# EasyEDA Pro project speedPulserPro.epro

# Schematic brd_speedPulserPro
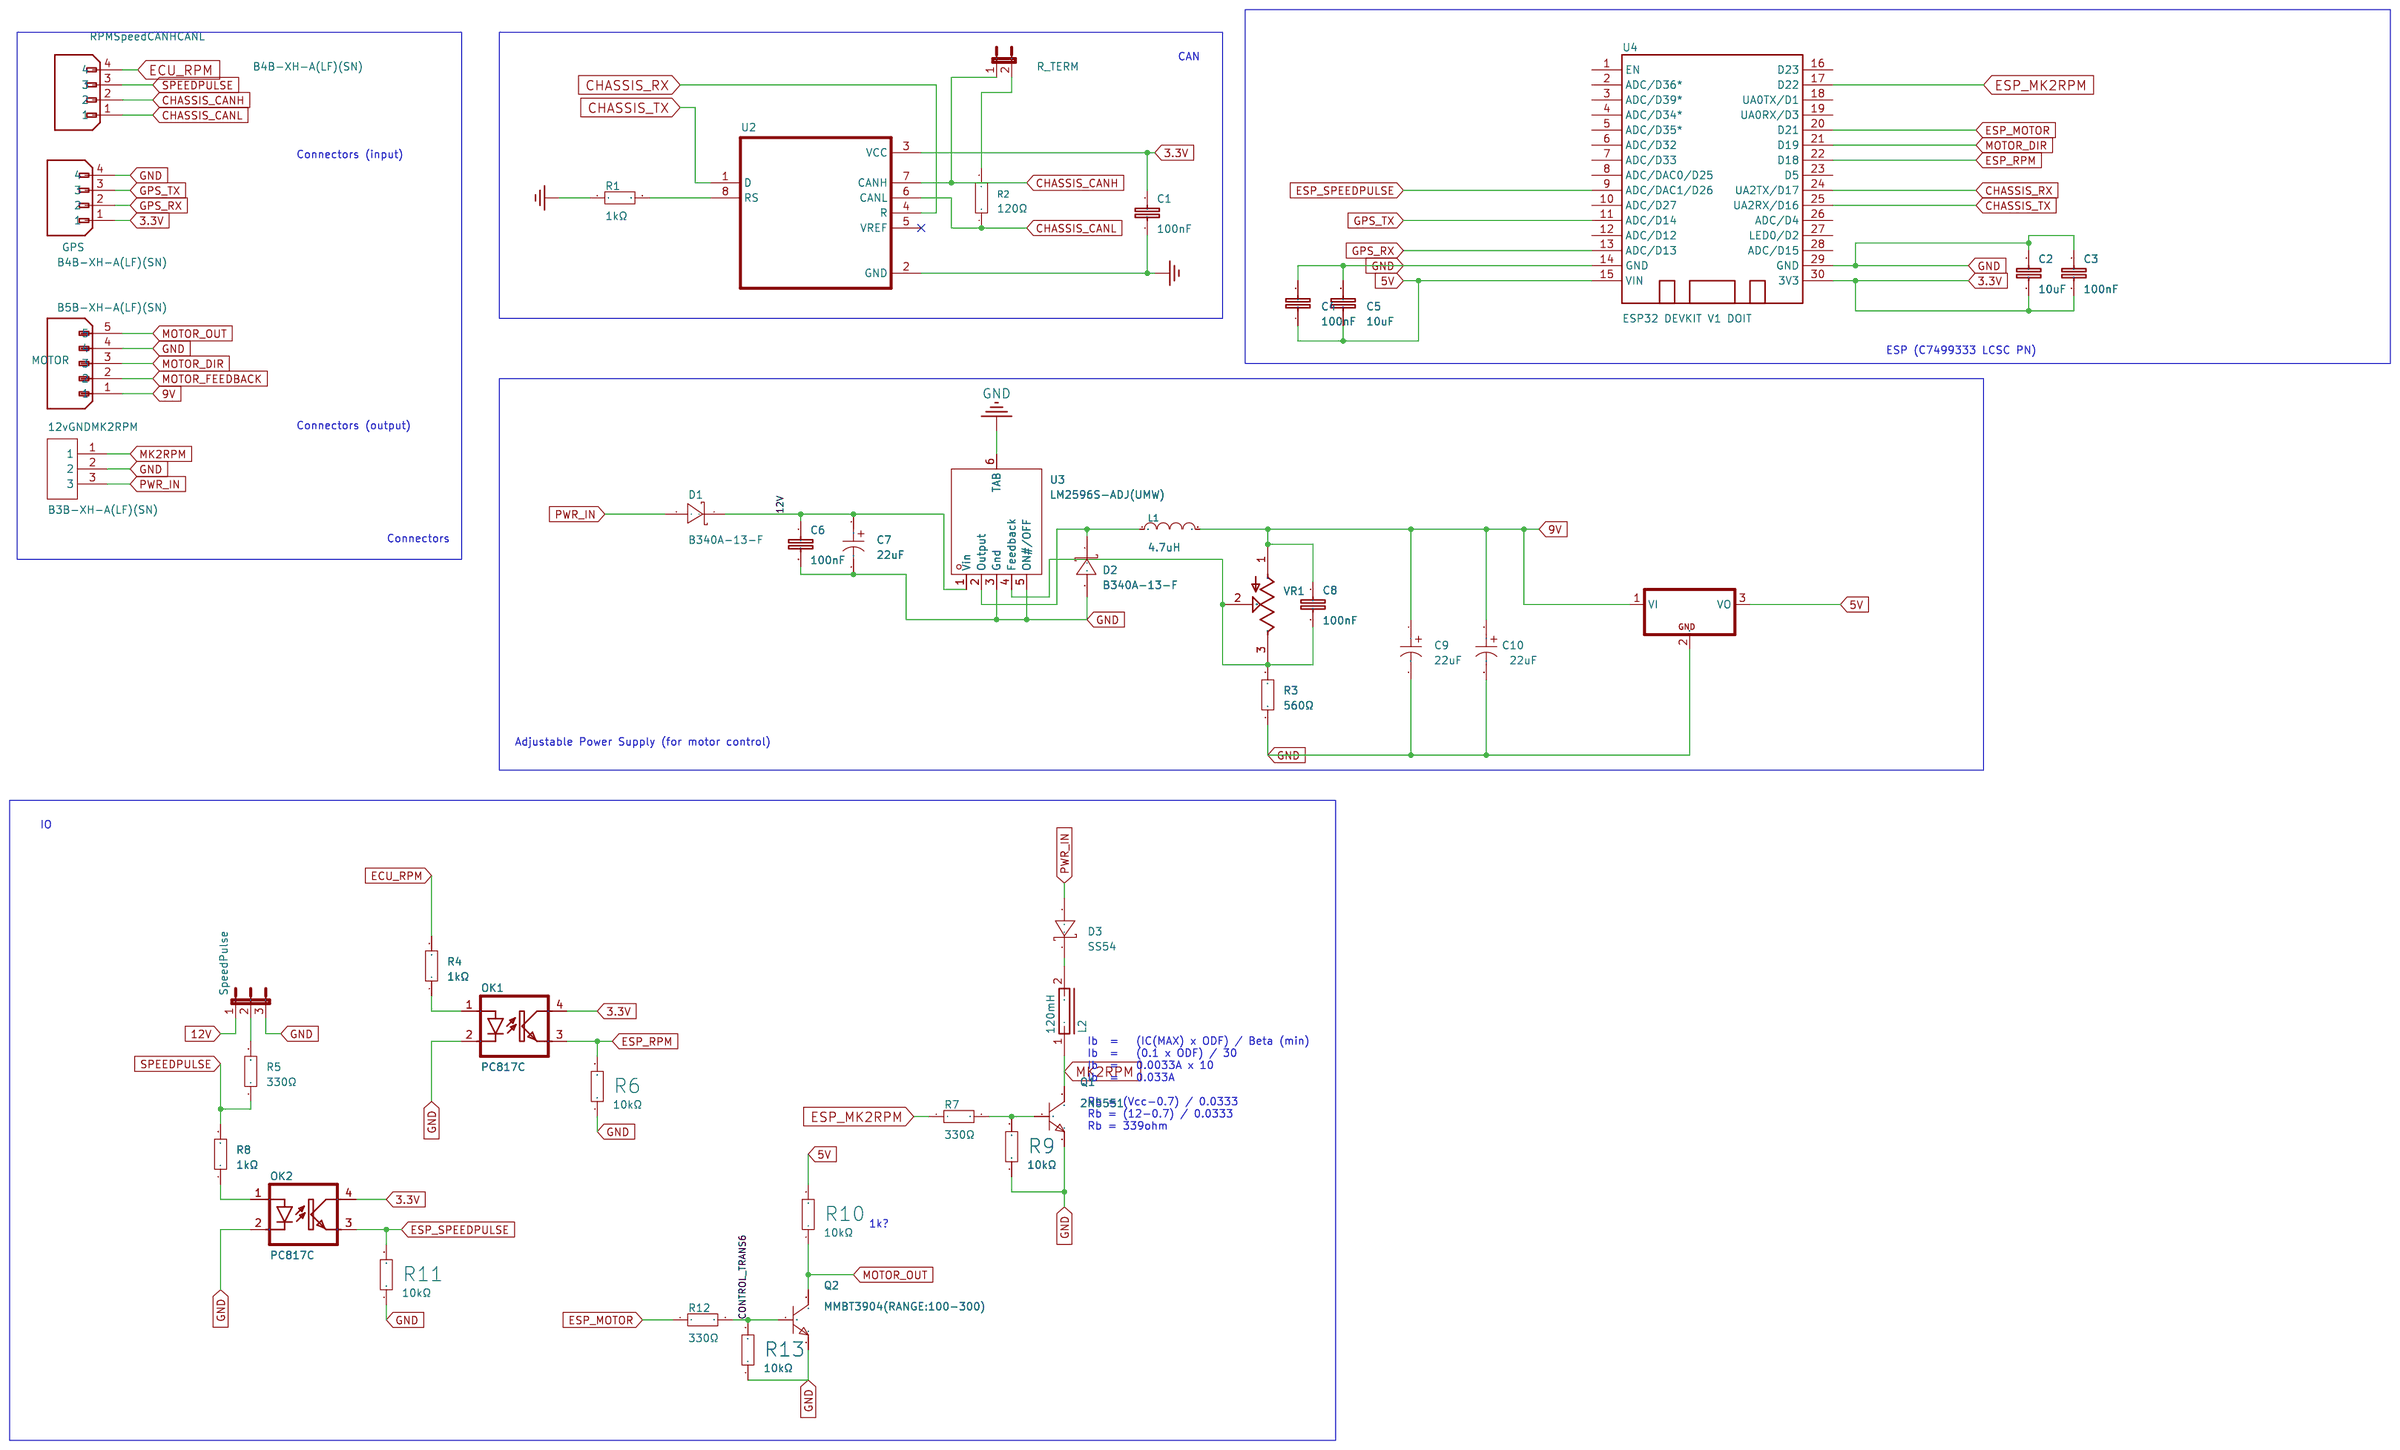
[diagram p0: schematic sheet]

## Parts
12vGNDMK2RPM  B3B-XH-A(LF)(SN)  [CONN-TH_3P-P2.50_A2501WV2-3P]
C1  100nF  [C0603]
C2  10uF  [C0805]
C3  100nF  [C0603]
C4  100nF  [C0603]
C5  10uF  [C0805]
C6  100nF  [C0805]
C7  22uF  [CAP-SMD_BD5.0-L5.3-W5.3-LS6.3-FD-1]
C8  100nF  [C0805]
C9  22uF  [CAP-SMD_BD5.0-L5.3-W5.3-LS6.3-FD-1]
C10  22uF  [CAP-SMD_BD5.0-L5.3-W5.3-LS6.3-FD-1]
D1  B340A-13-F  [SMA_L4.4-W2.6-LS5.0-RD]
D2  B340A-13-F  [SMA_L4.4-W2.6-LS5.0-RD]
D3  SS54  [SMA_L4.4-W2.8-LS5.4-R-RD]
GPS  B4B-XH-A(LF)(SN)  [CONN-TH_B4B-XH-A-LF-SN]
IC1  L7805ABD2T-TR  [TO-263-2_L10.0-W9.2-P5.08-LS15.3-TL-CW]
L1  4.7uH  [IND-SMD_L4.8-W4.5]
L2  120mH  [IND-SMD_L12.5-W12.5]
MOTOR  B5B-XH-A(LF)(SN)  [CONN-TH_B5B-XH-A-LF-SN]
OK1  PC817C  [OPTO-SMD-4_L4.6-W6.5-P2.54-LS10.3-TL]
OK2  PC817C  [OPTO-SMD-4_L4.6-W6.5-P2.54-LS10.3-TL]
Q1  2N5551  [SOT-23-3_L2.9-W1.4-P1.90-LS2.5-BR]
Q2  MMBT3904(RANGE:100-300)  [SOT-23-3_L2.9-W1.3-P1.90-LS2.4-BR]
R1  1kΩ  [R0603]
R2  120Ω  [R0603]
R3  560Ω  [R0603]
R4  1kΩ  [R0603]
R5  330Ω  [R0603]
R6  10kΩ  [R0603]
R7  330Ω  [R0603]
R8  1kΩ  [R0603]
R9  10kΩ  [R0603]
R10  10kΩ  [R0603]
R11  10kΩ  [R0603]
R12  330Ω  [R0603]
R13  10kΩ  [R0603]
R_TERM  PZ254V-11-02P  [HDR-TH_2P-P2.54-V-M]
RPMSpeedCANHCANL  B4B-XH-A(LF)(SN)  [CONN-TH_B4B-XH-A-LF-SN]
SpeedPulse  PZ254V-11-03P  [HDR-TH_3P-P2.54-V-M]
U2  SN65HVD230DR  [SOIC-8_L4.9-W3.9-P1.27-LS6.0-BL]
U3  LM2596S-ADJ(UMW)  [TO-263-5_L10.2-W8.9-P1.70-BR]
U4  ESP32 DEVKIT V1 DOIT  [DOIT-ESP32-DEVKIT-V1]
VR1  10kΩ  [RES-ADJ-TH_3362P]

## Library data of the parts
12vGNDMK2RPM = B3B-XH-A(LF)(SN): Pins Structure:1x3P Pitch:2.5mm Mounting Style:Direct Insert Reference Series:XH Number of Pins:3P Number of Rows:1 Number of PINs Per Row:3 Row Spacing:- Current Rating (Max):3A Contact Material:Brass Contact Plating:Tin Operating Temperature Range:-25℃~; LCSC Part Name: 1x3P 间距:2.5mm 直插 系列:XH; Supplier Part: C144394; Manufacturer: JST; Supplier Footprint: 插件,P=2.5mm; JLCPCB Part Class: Extended Part; Datasheet: https://atta.szlcsc.com/upload/public/pdf/source/20180928/C265283_F9DFEEBDB2CF642B6BDFAB4B77BD2680.pdf; Supplier: LCSC; Pins Structure: 1x3P; Pitch: 2.5mm; Mounting Style: Direct Insert; Reference Series: XH; Number of Pins: 3P; Number of Rows: 1; Number of PINs Per Row: 3; Current Rating (Max): 3A; Contact Material: Brass; Contact Plating: Tin; Operating Temperature Range: -25℃~+85℃; Rated Voltage (Max): 250V; Plastic Material: PA66; Flame Retardant Rating: UL94V-0; Supplementary Features: K-leg punch; Colour: White; Z-Height of the Board: 7mm; X-Length of Bottom Edge on Board (Spacing Line): 9.9mm; Y-Width of Bottom Edge on Board: 5.75mm
C1 C3 C4 = CC0603KRX7R9BB104: Capacitance:100nF Tolerance:±10% Tolerance:±10% Voltage Rating:50V Temperature Coefficient:X7R; LCSC Part Name: 100nF ±10% 50V; Supplier Part: C14663; Manufacturer: YAGEO(国巨); Supplier Footprint: 0603; JLCPCB Part Class: Basic Part; Datasheet: https://atta.szlcsc.com/upload/public/pdf/source/20250214/096C4C206003071F5D32E5F0D8E7F8DF.pdf; Supplier: LCSC; Tolerance: ±10%; Voltage Rating: 50V; Temperature Coefficient: X7R; Check: true
C2 C5 = CL21A106KAYNNNE_C15850: Capacitance: Tolerance:±10% Tolerance:±10% Voltage Rated: Temperature Coefficient:; LCSC Part Name: 10uF ±10% 25V; Supplier Part: C15850; Manufacturer: SAMSUNG(三星); Manufacturer Part: CL21A106KAYNNNE; Supplier Footprint: 0805; JLCPCB Part Class: Basic Part; Datasheet: https://atta.szlcsc.com/upload/public/pdf/source/20160218/1457707763339.pdf; Supplier: LCSC; Tolerance: ±10%; Check: true
C6 C8 = CT41G-0805-2X1-50V-0.1μF-K(N): Capacitance:100nF Tolerance:±10% Tolerance:±10% Voltage Rating:50V Temperature Coefficient:-; LCSC Part Name: 100nF ±10% 50V; Supplier Part: C126469; Manufacturer: TORCH(火炬); Supplier Footprint: 0805; JLCPCB Part Class: Extended Part; Datasheet: https://atta.szlcsc.com/upload/public/pdf/source/20171225/C150708_15141883600121203188.pdf; Supplier: LCSC; Tolerance: ±10%; Voltage Rating: 50V; Check: true
C7 C9 C10 = RST22UF35V025: Capacitance: Tolerance:±20% Tolerance:±20% Voltage Rated: Ripple Current:36mA@100kHz Equivalent Series Resistance(ESR):- Diameter: Height - Seated (Max): Lifetime @ Temp:2000hrs@105℃ Operating Temperature:-40℃~+105℃ Operating Temperature:-40℃~+105℃; LCSC Part Name: 22uF ±20% 35V; Supplier Part: C4747978; Manufacturer: KNSCHA(科尼盛); Supplier Footprint: SMD,D5xL5.4mm; JLCPCB Part Class: Extended Part; Datasheet: https://atta.szlcsc.com/upload/public/pdf/source/20220722/EA7DEE5E812CA06C1476767B895E1435.pdf; Supplier: LCSC; Tolerance: ±20%; Ripple Current: 36mA@100kHz; Lifetime @ Temp: 2000hrs@105℃; Operating Temperature: -40℃~+105℃; Check: true
D1 D2 = B340A-13-F: Forward Voltage (Vf@If):500mV@3A Reverse Voltage (Vr):40V Rectified Current:3A Reverse Leakage Current (Ir):500uA@40V; LCSC Part Name: 电压:40V 电流:3A; Supplier Part: C85098; Manufacturer: DIODES(美台); Supplier Footprint: SMA(DO-214AC); JLCPCB Part Class: Extended Part; Datasheet: https://atta.szlcsc.com/upload/public/pdf/source/20171023/C134454_15087453575121052549.pdf; Supplier: LCSC; Forward Voltage (Vf@If): 500mV@3A; Reverse Voltage (Vr): 40V; Rectified Current: 3A; Reverse Leakage Current (Ir): 500uA@40V; Check: true
D3 = SS54_C22452: Diode Configuration:Independent Type Forward Voltage (Vf@If):550mV@5A Reverse Voltage (Vr):40V Rectified Current:5A Reverse Leakage Current (Ir):1mA@40V; LCSC Part Name: 电压:40V 电流:5A; Supplier Part: C22452; Manufacturer: MDD(辰达半导体); Supplier Footprint: SMA(DO-214AC); JLCPCB Part Class: Basic Part; Datasheet: https://atta.szlcsc.com/upload/public/pdf/source/20240710/73DFBB65C1883B895E62D589679033DF.pdf; Supplier: LCSC; Diode Configuration: Independent Type; Forward Voltage (Vf@If): 550mV@5A; Reverse Voltage (Vr): 40V; Rectified Current: 5A; Reverse Leakage Current (Ir): 1mA@40V; Check: true
GPS RPMSpeedCANHCANL = B4B-XH-A(LF)(SN): Pins Structure:1x4P Pitch:2.5mm Mounting Style:Direct Insert Reference Series:XH Number of Pins:4P Number of Rows:1 Number of PINs Per Row:4 Row Spacing:- Current Rating (Max):3A Contact Material:Brass Contact Plating:Tin Operating Temperature Range:-25℃~; LCSC Part Name: 1x4P 间距:2.5mm 直插 系列:XH; Supplier Part: C144395; Manufacturer: JST; Supplier Footprint: 插件,P=2.5mm; JLCPCB Part Class: Extended Part; Datasheet: https://atta.szlcsc.com/upload/public/pdf/source/20180928/C265283_F9DFEEBDB2CF642B6BDFAB4B77BD2680.pdf; Supplier: LCSC; Pins Structure: 1x4P; Pitch: 2.5mm; Mounting Style: Direct Insert; Reference Series: XH; Number of Pins: 4P; Number of Rows: 1; Number of PINs Per Row: 4; Current Rating (Max): 3A; Contact Material: Brass; Contact Plating: Tin; Operating Temperature Range: -25℃~+85℃; Rated Voltage (Max): 250V; Plastic Material: PA66; Flame Retardant Rating: UL94V-0; Supplementary Features: K-leg punch; Colour: White; Z-Height of the Board: 7mm; X-Length of Bottom Edge on Board (Spacing Line): 12.4mm; Y-Width of Bottom Edge on Board: 5.75mm; Check: true
IC1 = L7805ABD2T-TR: Output Type:Fixed Maximum Input Voltage:35V Output Voltage:5V Output Voltage:5V Output Current:1.5A Power Supply Rejection Ratio (PSRR):68dB@(120Hz) Dropout Voltage:2V@(1A) standby current:6mA Feature:Short-Circuit  Protection；Thermal Protection(TSD) Oper; LCSC Part Name: 正稳压器IC; Supplier Part: C86206; Manufacturer: ST(意法半导体); Supplier Footprint: TO-263-2; JLCPCB Part Class: Extended Part; Datasheet: https://atta.szlcsc.com/upload/public/pdf/source/20191219/C472632_C0855675BBC73B8C8E44EE1325AAD56A.pdf; Supplier: LCSC; Output Type: Fixed; Maximum Input Voltage: 35V; Output Voltage: 5V; Output Current: 1.5A; Power Supply Rejection Ratio (PSRR): 68dB@(120Hz); Dropout Voltage: 2V@(1A); standby current: 6mA; Feature: Short-Circuit  Protection；Thermal Protection(TSD); Operating Temperature: -40℃~+125℃; Output Polarity: Positive electrode; Number of Outputs: 1; Check: true
L1 = SMMS0420-4R7M: Inductance: Tolerance:±20% Tolerance:±20% Rated Current: Saturation Current (Isat):3A DC Resistance (DCR): Type:一体成型电感; LCSC Part Name: 4.7uH ±20% 3A; Supplier Part: C133193; Manufacturer: SXN(顺翔诺); Supplier Footprint: SMD; JLCPCB Part Class: Extended Part; Datasheet: https://atta.szlcsc.com/upload/public/pdf/source/20210810/BBF24330FB2F5029F637830BA9C42C0D.pdf; Supplier: LCSC; Tolerance: ±20%; Saturation Current (Isat): 3A; Type: 一体成型电感; Check: true
L2 = DR125-124-R: Inductance:120mH Tolerance:±20% Tolerance:±20% Current Rating:60mA Current - Saturation(Isat):69mA DC Resistance(DCR):150Ω Type:- Ratings:-; LCSC Part Name: 120mH ±20% 69mA; Supplier Part: C2453120; Manufacturer: EATON(伊顿); Supplier Footprint: SMD,12.5x12.5mm; JLCPCB Part Class: Extended Part; Datasheet: https://atta.szlcsc.com/upload/public/pdf/source/20210417/1890D5F29C45E96B4D8E6D27BBAB5A55.pdf; Supplier: LCSC; Tolerance: ±20%; Current Rating: 60mA; Current - Saturation(Isat): 69mA; DC Resistance(DCR): 150Ω; Check: true
MOTOR = B5B-XH-A(LF)(SN): Pins Structure:1x5P Pitch:2.5mm Mounting Style:Direct Insert Reference Series:XH Number of Pins:5P Number of Rows:1 Number of PINs Per Row:5 Row Spacing:- Current Rating (Max):3A Contact Material:Brass Contact Plating:Tin Operating Temperature Range:-25℃~; LCSC Part Name: 1x5P 间距:2.5mm 直插 系列:XH; Supplier Part: C157991; Manufacturer: JST; Supplier Footprint: 插件,P=2.5mm; JLCPCB Part Class: Extended Part; Datasheet: https://atta.szlcsc.com/upload/public/pdf/source/20180928/C265283_F9DFEEBDB2CF642B6BDFAB4B77BD2680.pdf; Supplier: LCSC; Pins Structure: 1x5P; Pitch: 2.5mm; Mounting Style: Direct Insert; Reference Series: XH; Number of Pins: 5P; Number of Rows: 1; Number of PINs Per Row: 5; Current Rating (Max): 3A; Contact Material: Brass; Contact Plating: Tin; Operating Temperature Range: -25℃~+85℃; Rated Voltage (Max): 250V; Plastic Material: PA66; Flame Retardant Rating: UL94V-0; Supplementary Features: K-leg punch; Colour: White; Z-Height of the Board: 7mm; X-Length of Bottom Edge on Board (Spacing Line): 14.9mm; Y-Width of Bottom Edge on Board: 5.75mm; Check: true
OK1 OK2 = PC817C_C3025164: Input voltage type:DC Output Type:Phototransistor Voltage - Forward(Vf):1.2V Output Current:50mA Isolation Voltage(Vrms):5kV Reverse Voltage:6V Load Voltage:35V Number of Outputs:1 Vce Saturation(VCE(sat)):100mV@1mA,20mA Rise time:6us@2mA,100Ω Fall time:5; LCSC Part Name: C档 PC817C C档; Supplier Part: C3025164; Manufacturer: GOODWORK(固得沃克); Supplier Footprint: SMD-4P; JLCPCB Part Class: Extended Part; Datasheet: https://atta.szlcsc.com/upload/public/pdf/source/20240617/7F1B42AFA4D9649DF13B74B1E0B1F256.pdf; Supplier: LCSC; Input voltage type: DC; Output Type: Phototransistor; Voltage - Forward(Vf): 1.2V; Output Current: 50mA; Isolation Voltage(Vrms): 5kV; Reverse Voltage: 6V; Load Voltage: 35V; Number of Outputs: 1; Vce Saturation(VCE(sat)): 100mV@1mA,20mA; Rise time: 6us@2mA,100Ω; Fall time: 5us@2mA,100Ω; Operating Temperature: -55℃~+110℃; Current Transfer Ratio (CTR) Minimum: 200%; Current Transfer Ratio (CTR) Maximum/Saturation Value: 400%; Check: true
Q1 = 2N5551_C7529570: Transistor Type: Collector Current (Ic): Collector-Emitter Breakdown Voltage (Vceo): Power Dissipation (Pd):625mW DC Current Gain (hFE@Ic,Vce):80@10mA,5V DC Current Gain (hFE@Ic,Vce):80@10mA,5V Transition Frequency (fT):80MHz Collector Cut-Off Current (Ic; LCSC Part Name: NPN 电流:1A 耐压:160V; Supplier Part: C7529570; Manufacturer: RUILON(瑞隆源); Supplier Footprint: SOT-23; JLCPCB Part Class: Extended Part; Datasheet: https://atta.szlcsc.com/upload/public/pdf/source/20231206/D621ADD1802AEB70BE68282CC20D67DB.pdf; Supplier: LCSC; Power Dissipation (Pd): 625mW; DC Current Gain (hFE@Ic,Vce): 80@10mA,5V; Transition Frequency (fT): 80MHz; Collector Cut-Off Current (Icbo): 100nA; Collector-Emitter Saturation Voltage (VCE(sat)@Ic,Ib): 500mV@50mA,5mA; Operating Temperature: -55℃~+150℃; Check: true
Q2 = MMBT3904(RANGE:100-300): type:NPN Current - Collector(Ic): Collector - Emitter Voltage VCEO:40V Pd - Power Dissipation:200mW DC Current Gain:100@10mA,1V DC Current Gain:100@10mA,1V Transition frequency(fT):300MHz Current - Collector Cutoff:100nA Vce Saturation(VCE(sat)):300mV Ope; LCSC Part Name: hfe=100~300; Supplier Part: C20526; Manufacturer: CJ(江苏长电/长晶); Supplier Footprint: SOT-23; JLCPCB Part Class: Basic Part; Datasheet: https://atta.szlcsc.com/upload/public/pdf/source/20220704/70F575FB75061E03F919270A6BB8BA7F.pdf; Supplier: LCSC; type: NPN; Collector - Emitter Voltage VCEO: 40V; Pd - Power Dissipation: 200mW; DC Current Gain: 100@10mA,1V; Transition frequency(fT): 300MHz; Current - Collector Cutoff: 100nA; Vce Saturation(VCE(sat)): 300mV; Check: true
R1 R4 R8 = 0603WAF1001T5E: Type:Thick Film Resistors Resistance:1kΩ Tolerance:±1% Tolerance:±1% Power(Watts): Overload Voltage (Max): Temperature Coefficient:±100ppm/℃ Temperature Coefficient:±100ppm/℃ Operating Temperature Range:-55℃~+155℃ Operating Temperature Range:-55℃~+155℃; LCSC Part Name: 1kΩ ±1% 100mW 厚膜电阻; Supplier Part: C21190; Manufacturer: UNI-ROYAL(厚声); Supplier Footprint: 0603; JLCPCB Part Class: Basic Part; Datasheet: https://atta.szlcsc.com/upload/public/pdf/source/20200306/C422600_1E6D84923E4A46A82E41ADD87F860B5C.pdf; Supplier: LCSC; Type: Thick Film Resistors; Tolerance: ±1%; Temperature Coefficient: ±100ppm/℃; Operating Temperature Range: -55℃~+155℃; Check: true
R2 = 0603WAF1200T5E: Type:Thick Film Resistors Resistance: Tolerance:±1% Tolerance:±1% Power(Watts): Overload Voltage (Max): Temperature Coefficient:±100ppm/℃ Temperature Coefficient:±100ppm/℃ Operating Temperature Range:-55℃~+155℃ Operating Temperature Range:-55℃~+155℃; LCSC Part Name: 120Ω ±1% 100mW 厚膜电阻; Supplier Part: C22787; Manufacturer: UNI-ROYAL(厚声); Supplier Footprint: 0603; JLCPCB Part Class: Basic Part; Datasheet: https://atta.szlcsc.com/upload/public/pdf/source/20200306/C422600_1E6D84923E4A46A82E41ADD87F860B5C.pdf; Supplier: LCSC; Type: Thick Film Resistors; Tolerance: ±1%; Temperature Coefficient: ±100ppm/℃; Operating Temperature Range: -55℃~+155℃; Check: true
R3 = 0603WAF5600T5E: Type:Thick Film Resistors Resistance: Tolerance:±1% Tolerance:±1% Power(Watts): Overload Voltage (Max): Temperature Coefficient:±100ppm/℃ Temperature Coefficient:±100ppm/℃ Operating Temperature Range:-55℃~+155℃ Operating Temperature Range:-55℃~+155℃; LCSC Part Name: 560Ω ±1% 100mW 厚膜电阻; Supplier Part: C23204; Manufacturer: UNI-ROYAL(厚声); Supplier Footprint: 0603; JLCPCB Part Class: Basic Part; Datasheet: https://atta.szlcsc.com/upload/public/pdf/source/20200306/C422600_1E6D84923E4A46A82E41ADD87F860B5C.pdf; Supplier: LCSC; Type: Thick Film Resistors; Tolerance: ±1%; Temperature Coefficient: ±100ppm/℃; Operating Temperature Range: -55℃~+155℃; Check: true
R5 R7 R12 = 0603WAF3300T5E: Type:Thick Film Resistors Resistance: Tolerance:±1% Tolerance:±1% Power(Watts): Overload Voltage (Max): Temperature Coefficient:±100ppm/℃ Temperature Coefficient:±100ppm/℃ Operating Temperature Range:-55℃~+155℃ Operating Temperature Range:-55℃~+155℃; LCSC Part Name: 330Ω ±1% 100mW 厚膜电阻; Supplier Part: C23138; Manufacturer: UNI-ROYAL(厚声); Supplier Footprint: 0603; JLCPCB Part Class: Basic Part; Datasheet: https://atta.szlcsc.com/upload/public/pdf/source/20200306/C422600_1E6D84923E4A46A82E41ADD87F860B5C.pdf; Supplier: LCSC; Type: Thick Film Resistors; Tolerance: ±1%; Temperature Coefficient: ±100ppm/℃; Operating Temperature Range: -55℃~+155℃; Check: true
R6 R9-R11 R13 = 0603WAF1002T5E: Type:Thick Film Resistor Resistance:10kΩ Tolerance:±1% Tolerance:±1% Power(Watts):100mW Voltage-Supply(Max):75V Temperature Coefficient:±100ppm/℃ Temperature Coefficient:±100ppm/℃ Operating Temperature:-55℃~+155℃ Operating Temperature:-55℃~+155℃; LCSC Part Name: 厚膜电阻 10kΩ ±1% 100mW; Supplier Part: C25804; Manufacturer: UNI-ROYAL(厚声); Supplier Footprint: 0603; JLCPCB Part Class: Basic Part; Datasheet: https://atta.szlcsc.com/upload/public/pdf/source/20200306/C422600_1E6D84923E4A46A82E41ADD87F860B5C.pdf; Supplier: LCSC; Type: Thick Film Resistor; Tolerance: ±1%; Power(Watts): 100mW; Voltage-Supply(Max): 75V; Temperature Coefficient: ±100ppm/℃; Operating Temperature: -55℃~+155℃; Check: true
R_TERM = PZ254V-11-02P: Pin Structure:1x2P Pitch:2.54mm Row Spacing:- Circluar Pins/Square Pins:Policy Mounting Type:Straight Number of Rows:Single Row Number of Pins:2P Current Rating:- Voltage Rating (Max):- Length of Mating Pin:6mm Insulation Height:2.5mm Length of End Connec; LCSC Part Name: 1x2P 间距:2.54mm 方针 直插; Supplier Part: C492401; Manufacturer: XFCN(兴飞); Supplier Footprint: 插件,P=2.54mm; JLCPCB Part Class: Extended Part; Datasheet: https://atta.szlcsc.com/upload/public/pdf/source/20200309/C492401_A812433581A9B211A7FFA413ADDFF0E5.pdf; Supplier: LCSC; Pin Structure: 1x2P; Pitch: 2.54mm; Circluar Pins/Square Pins: Policy; Mounting Type: Straight; Number of Rows: Single Row; Number of Pins: 2P; Length of Mating Pin: 6mm; Insulation Height: 2.5mm; Length of End Connection Pin: 3mm; Contact Material: Brass; Operating Temperature: -40℃~+105℃; Color: Black; Check: true
SpeedPulse = PZ254V-11-03P: Pin Structure:1x3P Pitch:2.54mm Row Spacing:- Circluar Pins/Square Pins:Policy Mounting Type:Straight Number of Rows:Single Row Number of Pins:3P Current Rating:3A Voltage Rating (Max):250V Length of Mating Pin:6mm Insulation Height:2.5mm Length of End Co; LCSC Part Name: 1x3P 间距:2.54mm 方针 直插; Supplier Part: C2937625; Manufacturer: XFCN(兴飞); Supplier Footprint: 插件,P=2.54mm; JLCPCB Part Class: Extended Part; Datasheet: https://atta.szlcsc.com/upload/public/pdf/source/20200309/C492402_8335C3D49C4E4C618838D59BB1D024C1.pdf; Supplier: LCSC; Pin Structure: 1x3P; Pitch: 2.54mm; Circluar Pins/Square Pins: Policy; Mounting Type: Straight; Number of Rows: Single Row; Number of Pins: 3P; Current Rating: 3A; Voltage Rating (Max): 250V; Length of Mating Pin: 6mm; Insulation Height: 2.5mm; Length of End Connection Pin: 3mm; Operating Temperature: -40℃~+105℃; Color: Black; Check: true
U2 = SN65HVD230DR: Type:CANtransceiver Data Rate:1Mbps Voltage - Supply:- Voltage - Supply:- Current - Supply:- Operating Temperature:-40℃~+85℃ Operating Temperature:-40℃~+85℃; LCSC Part Name: 3.3-V CAN 收发器; Supplier Part: C12084; Manufacturer: TI(德州仪器); Supplier Footprint: SOIC-8; JLCPCB Part Class: Extended Part; Datasheet: https://www.ti.com/cn/lit/gpn/sn65hvd230; Supplier: LCSC; Type: CANtransceiver; Data Rate: 1Mbps; Operating Temperature: -40℃~+85℃; Check: true
U3 = LM2596S-ADJ(UMW): Function:Step-down type Output Type:Adjustable Input Voltage:40V Input Voltage:40V Output Voltage:1.2V~37V Output Voltage:1.2V~37V Output Current:3A Switching Frequency:150kHz Switching Frequency:150kHz Operating Temperature:-40℃~+125℃@(TA) Operating Temp; LCSC Part Name: 3A降压稳压器; Supplier Part: C347423; Manufacturer: UMW(友台半导体); Supplier Footprint: TO-263-5; JLCPCB Part Class: Extended Part; Datasheet: https://atta.szlcsc.com/upload/public/pdf/source/20241113/7515F50B4FEE0270D4DE7078364C87FA.pdf; Supplier: LCSC; Function: Step-down type; Output Type: Adjustable; Input Voltage: 40V; Output Voltage: 1.2V~37V; Output Current: 3A; Switching Frequency: 150kHz; Operating Temperature: -40℃~+125℃@(TA); Synchronous Rectification: No; Number of Outputs: 1; Topology: Step-down; Quiescent Current (Iq): 80uA; Switch tube (built-in/external): Built-in; Check: true
U4 = ESP32 DEVKIT V1 DOIT
VR1 = 3362P-1-103_C118956: Resistance: Tolerance:±10% Tolerance:±10%; LCSC Part Name: 10kΩ ±10%; Supplier Part: C118956; Manufacturer: BOCHEN(博晨); Manufacturer Part: 3362P-1-103; Supplier Footprint: 插件; JLCPCB Part Class: Extended Part; Datasheet: https://atta.szlcsc.com/upload/public/pdf/source/20171114/C118956_15106326650691117445.pdf; Supplier: LCSC; Tolerance: ±10%; Check: true

## Nets
3.3V: C1.1 C2.2 C3.2 GPS.1 OK1.4(COL) OK2.4(COL) U2.3(VCC) U4.30(3V3)
5V: C4.1 C5.1 IC1.3(VO) R10.2 U4.15(VIN)
9V: C8.1 C9.1 C10.1 IC1.1(VI) L1.2 MOTOR.1 VR1.1(CCW)
12V: C6.1 C7.1 D1.1(K) SpeedPulse.1 U3.1(Vin)
GND: 12vGNDMK2RPM.2 C1.2 C2.1 C3.1 C4.2 C5.2 C6.2 C7.2 C9.2 C10.2 D2.2(A) GPS.4 IC1.2(GND) MOTOR.4 OK1.2(C) OK2.2(C) Q1.2(E) Q2.2(E) R1.1 R3.1 R6.1 R9.1 R11.1 R13.1 SpeedPulse.3 U2.2(GND) U3.3(Gnd) U3.5(ON#/OFF) U3.6(TAB) U4.14(GND) U4.29(GND)
CHASSIS_CANH: R_TERM.1 RPMSpeedCANHCANL.2 U2.7(CANH)
CHASSIS_CANL: R2.1 RPMSpeedCANHCANL.1 U2.6(CANL)
CHASSIS_RX: U2.4(R) U4.24(UA2TX/D17)
CHASSIS_TX: U2.1(D) U4.25(UA2RX/D16)
CONTROL_TRANS6: Q2.1(B) R12.2 R13.2
ECU_RPM: R4.2 RPMSpeedCANHCANL.4
ESP_MK2RPM: R7.1 U4.17(D22)
ESP_MOTOR: R12.1 U4.20(D21)
ESP_RPM: OK1.3(EMIT) R6.2 U4.22(D18)
ESP_SPEEDPULSE: OK2.3(EMIT) R11.2 U4.9(ADC/DAC1/D26)
GPS_RX: GPS.2 U4.13(ADC/D13)
GPS_TX: GPS.3 U4.11(ADC/D14)
MK2RPM: 12vGNDMK2RPM.1 L2.1 Q1.3(C)
MOTOR_DIR: MOTOR.3 U4.21(D19)
MOTOR_FEEDBACK: MOTOR.2
MOTOR_OUT: MOTOR.5 Q2.3(C) R10.1
N$6: D2.1(K) L1.1 U3.2(Output)
N$7: C8.2 R3.2 U3.4(Feedback) VR1.2(WIPER) VR1.3(CW)
PWR_IN: 12vGNDMK2RPM.3 D1.2(A) D3.1(A)
SPEEDPULSE: R5.1 R8.2 RPMSpeedCANHCANL.3
$1N14244: R1.2 U2.8(RS)
$1N14293: R2.2 R_TERM.2
$1N14383: OK2.1(A) R8.1
$1N14386: R5.2 SpeedPulse.2
$1N14388: D3.2(K) L2.2
$1N14393: Q1.1(B) R7.2 R9.2
$1N14714: OK1.1(A) R4.1

Not connected (* = marked no-connect by the designer): U2 5(VREF)*; U4 1(EN) 2(ADC/D36*) 3(ADC/D39*) 4(ADC/D34*) 5(ADC/D35*) 6(ADC/D32) 7(ADC/D33) 8(ADC/DAC0/D25) 10(ADC/D27) 12(ADC/D12) 16(D23) 18(UA0TX/D1) 19(UA0RX/D3) 23(D5) 26(ADC/D4) 27(LED0/D2) 28(ADC/D15)

## Notes on the sheet
- CAN
- Connectors (input)
- ESP (C7499333 LCSC PN)
- Connectors (output)
- Connectors
- Adjustable Power Supply (for motor control)
- IO
- Ib  =   (IC(MAX) x ODF) / Beta (min)
  Ib  =   (0.1 x ODF) / 30
  Ib  =   0.0033A x 10
  Ib  =   0.033A
  Rb = (Vcc-0.7) / 0.0333
  Rb = (12-0.7) / 0.0333
  Rb = 339ohm
- 1k?

# Board brd_speedPulserPro
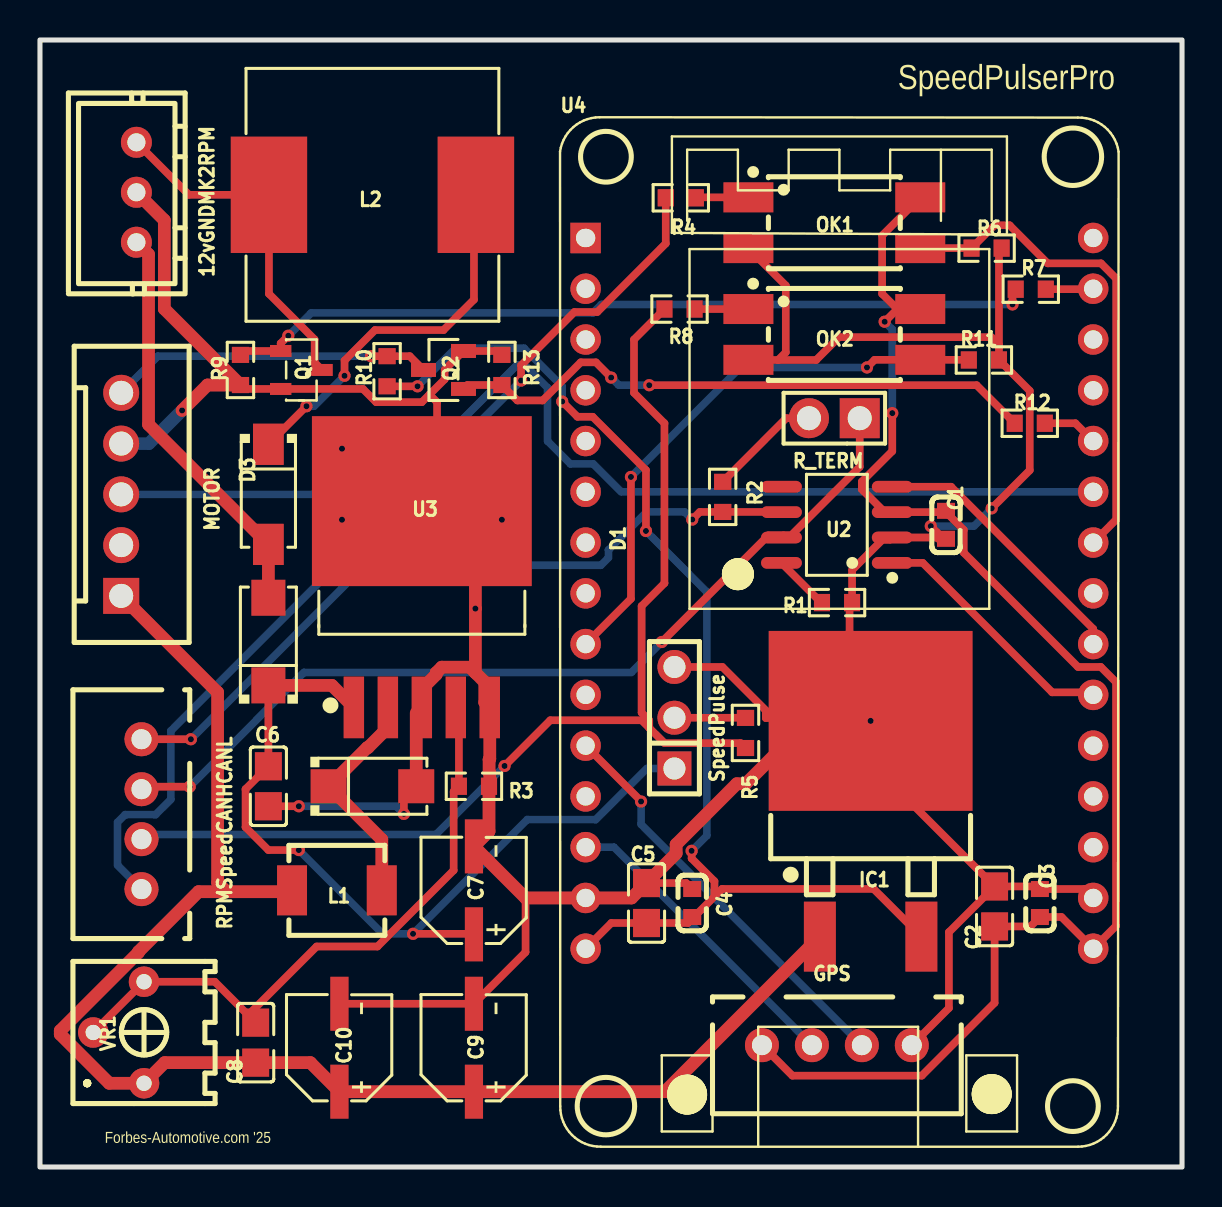
[diagram p1: board, top side]
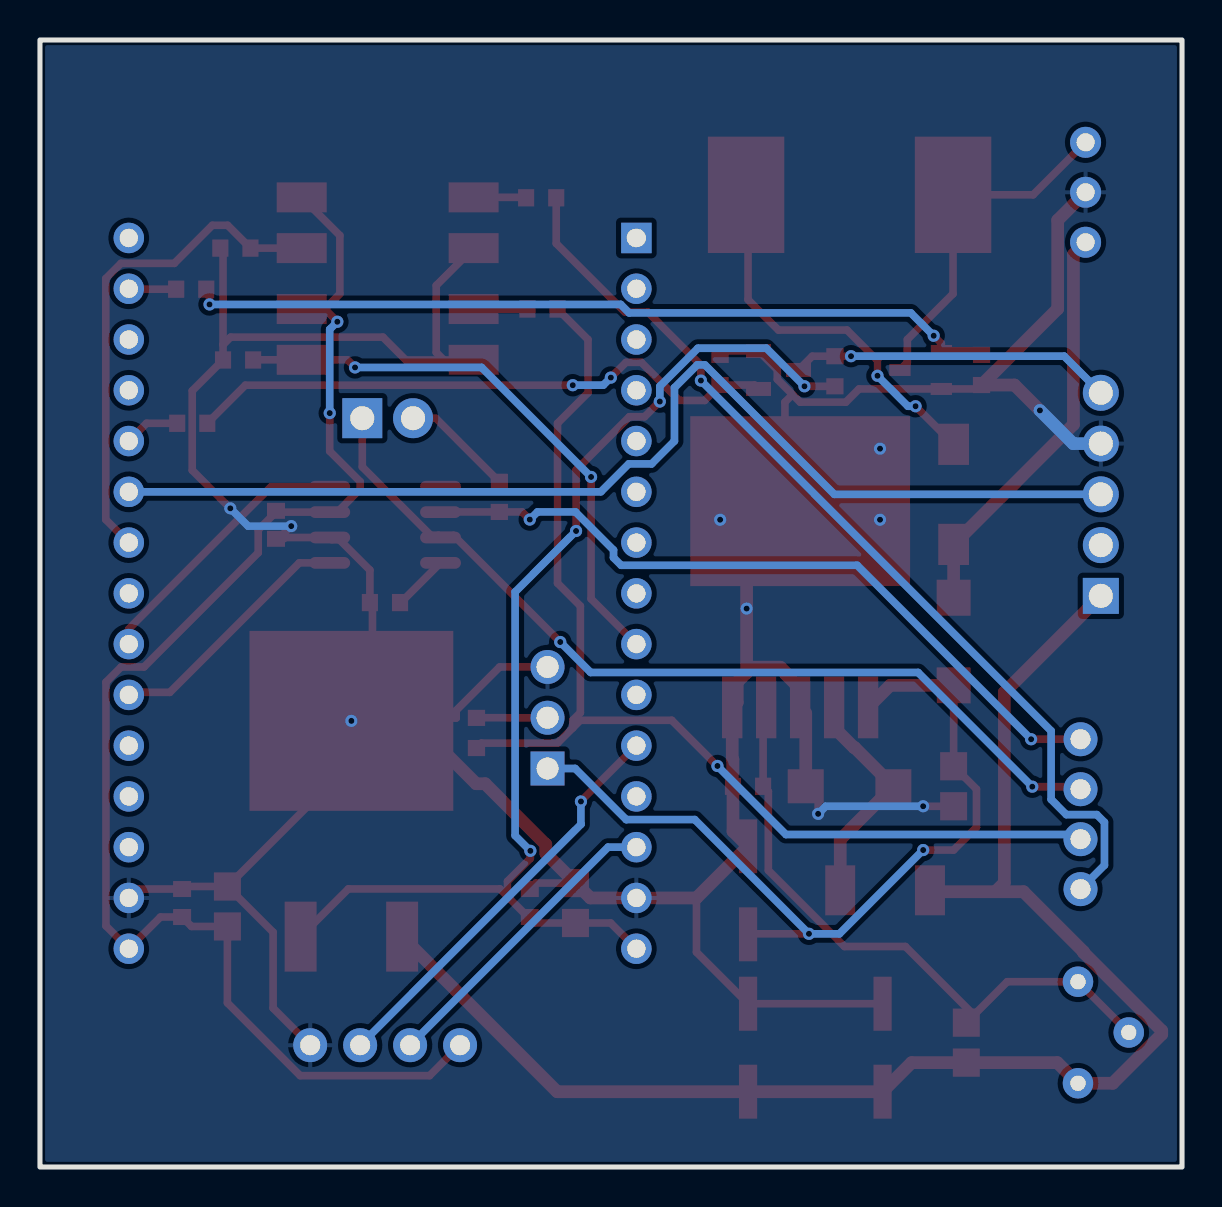
[diagram p2: board, bottom side, seen from below]

Outline 57.15 x 56.39 mm; copper layers: Top Layer, Bottom Layer. Coordinates in mm from the lower left corner of the outline.
Outline path: rectangle 0,56.39 57.15,0
Stack: Top Layer 0.035mm / Dielectric1 1.51mm FR4 er 4.5 / Bottom Layer 0.035mm

## Design rules (mm)
net CHASSIS_CANH: DP1
net CHASSIS_TX: DP2
net GPS_RX: DP3
net GPS_TX: DP3
net CHASSIS_CANL: DP1
net CHASSIS_RX: DP2
template: Custom Config
spacing copperThickness1oz (default): track to track 0.102, other pairs 0.152 to 0.3
spacing copperThickness2oz: track to track 0.203, other pairs 0.152 to 0.3
track width copperThickness1oz (default): min 0.305, default 0.381, max 2.54
track width copperThickness2oz: min 0.508, default 0.635, max 2.54
differential pair differentialPair (default): width min 0.127, default 0.254, max 2.54; gap min 0.152, default 0.152
via viaSize (default): diameter min 0.5, default 0.61, max 10; hole min 0.3, default 0.305, max 6.3
net 12V uses copperThickness2oz
net 9V uses copperThickness2oz

## Placement (name value [footprint] x y rotation side)
12vGNDMK2RPM  B3B-XH-A(LF)(SN)  [CONN-TH_3P-P2.50_A2501WV2-3P]  4.83 48.77 270 top
C1  100nF  [C0603]  45.34 32.13 270 top
C2  10uF  [C0805]  47.77 13.04 270 top
C3  100nF  [C0603]  50.04 13.21 270 top
C4  100nF  [C0603]  32.64 13.21 90 top
C5  10uF  [C0805]  30.35 13.21 90 top
C6  100nF  [C0805]  11.43 19.05 270 top
C7  22uF  [CAP-SMD_BD5.0-L5.3-W5.3-LS6.3-FD-1]  21.72 13.84 90 top
C8  100nF  [C0805]  10.8 6.22 90 top
C9  22uF  [CAP-SMD_BD5.0-L5.3-W5.3-LS6.3-FD-1]  21.72 5.97 90 top
C10  22uF  [CAP-SMD_BD5.0-L5.3-W5.3-LS6.3-FD-1]  14.99 5.97 90 top
D1  B340A-13-F  [SMA_L4.4-W2.6-LS5.0-RD]  11.43 26.29 90 top
D2  B340A-13-F  [SMA_L4.4-W2.6-LS5.0-RD]  16.64 19.05 0 top
D3  SS54  [SMA_L4.4-W2.8-LS5.4-R-RD]  11.43 33.66 270 top
GPS  B4B-XH-A(LF)(SN)  [CONN-TH_B4B-XH-A-LF-SN]  39.88 6.1 180 top
IC1  L7805ABD2T-TR  [TO-263-2_L10.0-W9.2-P5.08-LS15.3-TL-CW]  41.57 16.92 90 top
L1  4.7uH  [IND-SMD_L4.8-W4.5]  14.86 13.84 180 top
L2  120mH  [IND-SMD_L12.5-W12.5]  16.64 48.64 180 top
MOTOR  B5B-XH-A(LF)(SN)  [CONN-TH_B5B-XH-A-LF-SN]  4.06 33.66 270 top
OK1  PC817C  [OPTO-SMD-4_L4.6-W6.5-P2.54-LS10.3-TL]  39.75 47.24 0 top
OK2  PC817C  [OPTO-SMD-4_L4.6-W6.5-P2.54-LS10.3-TL]  39.75 41.66 0 top
Q1  2N5551  [SOT-23-3_L2.9-W1.4-P1.90-LS2.5-BR]  13.08 39.88 180 top
Q2  MMBT3904(RANGE:100-300)  [SOT-23-3_L2.9-W1.3-P1.90-LS2.4-BR]  20.19 39.88 0 top
R1  1kΩ  [R0603]  39.89 28.24 180 top
R2  120Ω  [R0603]  34.16 33.53 90 top
R3  560Ω  [R0603]  21.72 19.05 180 top
R4  1kΩ  [R0603]  32.07 48.49 180 top
R5  330Ω  [R0603]  35.31 21.72 90 top
R6  10kΩ  [R0603]  47.37 45.97 180 top
R7  330Ω  [R0603]  49.58 43.92 180 top
R8  1kΩ  [R0603]  32 42.93 180 top
R9  10kΩ  [R0603]  10.03 39.88 90 top
R10  10kΩ  [R0603]  17.37 39.81 270 top
R11  10kΩ  [R0603]  47.24 40.38 180 top
R12  330Ω  [R0603]  49.53 37.21 180 top
R13  10kΩ  [R0603]  23.11 39.88 270 top
R_TERM  PZ254V-11-02P  [HDR-TH_2P-P2.54-V-M]  39.75 37.47 180 top
RPMSpeedCANHCANL  B4B-XH-A(LF)(SN)  [CONN-TH_B4B-XH-A-LF-SN]  5.08 17.65 90 top
SpeedPulse  PZ254V-11-03P  [HDR-TH_3P-P2.54-V-M]  31.75 22.48 90 top
U2  SN65HVD230DR  [SOIC-8_L4.9-W3.9-P1.27-LS6.0-BL]  39.88 32.13 90 top
U3  LM2596S-ADJ(UMW)  [TO-263-5_L10.2-W8.9-P1.70-BR]  19.11 28.16 270 top
U4  ESP32 DEVKIT V1 DOIT  [DOIT-ESP32-DEVKIT-V1]  27.3 46.48 0 top
VR1  10kΩ  [RES-ADJ-TH_3362P]  3.94 6.73 90 top

## Footprints (pads in the part's own frame, mm; a bottom-side part is the same pattern mirrored in y, then rotated)
C0603
  rect 0.8x0.9 smd: 1(-0.7,0) 2(0.7,0)
C0805
  rect 1.41x1.35 smd: 1(-1,0) 2(1,0)
CAP-SMD_BD5.0-L5.3-W5.3-LS6.3-FD-1
  rect 2.7x0.91 smd: 1(-2.2,0) 2(2.2,0)
CONN-TH_3P-P2.50_A2501WV2-3P
  round 1.55 hole 0.9: 1(-2.5,0) 2(0,0) 3(2.5,0)
CONN-TH_B4B-XH-A-LF-SN
  round 1.7 hole 1: 1(3.75,0) 2(1.25,0) 3(-1.25,0) 4(-3.75,0)
CONN-TH_B5B-XH-A-LF-SN
  rect 1.8x1.8 hole 1.2: 1(5.08,0)
  round 1.8 hole 1.2: 2(2.54,0) 3(0,0) 4(-2.54,0) 5(-5.08,0)
DOIT-ESP32-DEVKIT-V1
  rect 1.524x1.524 hole 0.96x0.914: 1(0,0)
  round 1.524 hole 0.914: 2(0,-2.54) 3(0,-5.08) 4(0,-7.62) 5(0,-10.16) 6(0,-12.7) 7(0,-15.24) 8(0,-17.78) 9(0,-20.32) 10(0,-22.86) 11(0,-25.4) 12(0,-27.94) 13(0,-30.48) 14(0,-33.02) 15(0,-35.56) 16(25.4,0) 17(25.4,-2.54) 18(25.4,-5.08) 19(25.4,-7.62) 20(25.4,-10.16) 21(25.4,-12.7) 22(25.4,-15.24) 23(25.4,-17.78) 24(25.4,-20.32) 25(25.4,-22.86) 26(25.4,-25.4) 27(25.4,-27.94) 28(25.4,-30.48) 29(25.4,-33.02) 30(25.4,-35.56)
HDR-TH_2P-P2.54-V-M
  rect 2x2 hole 1.2: 1(-1.27,0)
  round 2 hole 1.2: 2(1.27,0)
HDR-TH_3P-P2.54-V-M
  rect 1.7x1.7 hole 1.1: 1(-2.54,0)
  round 1.7 hole 1.1: 2(0,0) 3(2.54,0)
IND-SMD_L4.8-W4.5
  rect 1.5x2.5 smd: 1(-2.245,0) 2(2.245,0)
IND-SMD_L12.5-W12.5
  rect 3.824x5.82 smd: 1(5.178,0) 2(-5.178,0)
OPTO-SMD-4_L4.6-W6.5-P2.54-LS10.3-TL
  rect 2.5x1.5 smd: 1(-4.3,1.27) 2(-4.3,-1.27) 3(4.3,-1.27) 4(4.3,1.27)
R0603
  rect 0.806x0.864 smd: 1(-0.753,0) 2(0.753,0)
RES-ADJ-TH_3362P
  round 1.524 hole 0.762: 1(-2.54,-1.27) 2(0,1.27) 3(2.54,-1.27)
SMA_L4.4-W2.6-LS5.0-RD
  rect 1.8x1.7 smd: 1(-2.192,0) 2(2.192,0)
SMA_L4.4-W2.8-LS5.4-R-RD
  rect 2.062x1.539 smd: 1(2.503,0) 2(-2.503,0)
SOIC-8_L4.9-W3.9-P1.27-LS6.0-BL
  oval 0.588x2.045 smd: 1(-1.905,-2.772) 2(-0.635,-2.772) 3(0.635,-2.772) 4(1.905,-2.772) 5(1.905,2.772) 6(0.635,2.772) 7(-0.635,2.772) 8(-1.905,2.772)
SOT-23-3_L2.9-W1.3-P1.90-LS2.4-BR
  rect 1.25x0.7 smd: 1(1,-0.95) 2(1,0.95) 3(-1,0)
SOT-23-3_L2.9-W1.4-P1.90-LS2.5-BR
  rect 1.07x0.6 smd: 1(1.035,-0.95) 2(1.035,0.95) 3(-1.035,0)
TO-263-2_L10.0-W9.2-P5.08-LS15.3-TL-CW
  rect 3.5x1.6 smd: 1(-5.397,2.54) 3(-5.397,-2.54)
  rect 9x10.2 smd: 2(5.397,0)
TO-263-5_L10.2-W8.9-P1.70-BR
  rect 3.083x1.02 smd: 1(5.16,-3.4) 2(5.16,-1.7) 3(5.16,0) 4(5.16,1.7) 5(5.16,3.4)
  rect 8.5x11 smd: 6(-5.16,0)

## Nets
As in the schematic.

Pads without a net: U2 5; U4 1 2 3 4 5 6 7 8 10 12 16 18 19 23 26 27 28

## Via types
v1: diameter 0.61, hole 0.305, Top Layer to Bottom Layer, 34 vias

## Routing (per net, layer and track width the routed paths; a pad name or vN(x,y) marks a point on that pad's centre or on a via; arc(x,y) is an arc through that point)
3.3V: length 72.6
  Top Layer w0.381: v1(42.65,37.72) 42.65,35.81 41.13,34.29 41.13,33.91 42.27,32.77 U2.3 45.34,32.77 ; 42.9,42.93 42.14,43.69 42.14,46.61 OK1.4 ; 42.9,42.93 OK2.4 ; 42.9,42.93 v1(42.27,42.29) ; 45.34,32.77 46.23,31.88 46.23,30.73 51.94,25.02 53.09,25.02 53.85,24.26 53.85,12.06 U4.30 51.12,12.51 C3.2 49.57,12.04 C2.2 47.77,8.21 44.13,4.57 37.65,4.57 GPS.1 ; 45.34,32.77 C1.1
  Bottom Layer w0.381: v1(42.65,37.72) 42.65,41.91 v1(42.27,42.29)
5V: length 59.1
  Top Layer w0.381: v1(32.61,15.82) 32.61,15.44 33.75,14.3 33.75,13.53 ; R10.2 v1(18.89,39.06) ; U4.15 28.59,12.21 C5.1 32.43,12.21 33.75,13.53 ; IC1.3 41.72,13.91 34.13,13.91 33.75,13.53 ; v1(26.13,38.3) 26.89,37.54 27.66,37.54 30.32,34.87 v1(30.32,31.82)
  Bottom Layer w0.381: v1(30.32,31.82) 33.37,28.77 33.37,16.58 v1(32.61,15.82) ; v1(26.13,38.3) 26.13,39.06 24.23,40.97 20.8,40.97 v1(18.89,39.06)
9V: length 75
  Top Layer w0.635: L1.2 12.55,13.78 9.34,13.78 ; MOTOR.1 8.89,23.75 8.89,14.22 9.34,13.78 ; 9.34,13.78 7.93,13.78 4.93,10.77 4.93,10.74 1.02,6.82 1.02,6.64 3.47,4.19 5.21,4.19 6.24,5.22 C8.1 13.53,5.22 C10.1 C9.1 31.27,3.77 IC1.1
12V: length 42.5
  Top Layer w0.381: D1.1 C6.1 10.29,18.91 10.29,17 11.43,15.86 v1(12.95,15.86) ; v1(18.67,11.67) 21.69,11.67 C7.1
  Top Layer w0.635: U3.1 14.61,24.1 D1.1
  Bottom Layer w0.381: SpeedPulse.1 30.37,19.94 27.81,17.38 24.38,17.38 v1(18.67,11.67) 17.14,11.67 v1(12.95,15.86)
GND: length 202.9
  Top Layer w0.381: OK2.2 35.46,40.38 36.94,40.38 ; C5.2 32.34,14.21 C4.2 ; v1(44.58,32.07) 44.89,31.75 44.89,31.5 ; 36.94,40.38 38.84,40.38 39.99,41.52 47.61,41.52 47.99,41.14 ; 36.94,40.38 37.32,40.76 37.32,44.1 OK1.2 ; C10.2 C9.2 24.3,10.75 24.3,13.46 ; 19.49,38.65 19.87,38.27 19.87,34.08 U3.6 ; 19.49,38.65 19.11,38.27 16.82,38.27 16.16,38.93 Q1.2 10.23,38.93 R9.1 ; 19.49,38.65 20.25,39.41 20.25,39.89 Q2.2 22.92,40.83 R13.1 ; C2.1 49.91,14.04 C3.1 52.26,13.91 U4.29 ; C2.1 41.57,20.24 v1(41.57,22.32) ; C2.1 45.48,11.75 45.48,7.95 GPS.4 ; SpeedPulse.3 34.15,25.02 36.32,22.84 36.32,22.46 40.51,22.46 40.51,28.11 R1.1 40.64,29.87 42.16,31.39 42.55,31.39 U2.2 44.89,31.5 ; 44.89,31.5 44.96,31.43 C1.2 45.27,31.5 44.89,31.5 ; 47.99,41.14 47.99,45.84 R6.1 ; 47.99,41.14 R11.1 49.53,38.84 49.53,34.86 v1(47.62,32.95) ; C6.2 v1(12.95,18.05) ; v1(18.21,17.67) 18.21,18.43 D2.2
  Top Layer w0.635: 12vGNDMK2RPM.2 6.22,47.37 6.22,42.93 R9.1 8.38,39.12 v1(7.11,37.85) ; 21.79,24.73 v1(21.79,27.94) 21.79,30.64 U3.6 ; 21.79,24.73 21.51,25.01 20.1,25.01 19.83,24.73 19.83,24.65 19.11,23.92 U3.3 ; 21.79,24.73 22.26,24.26 22.26,23.25 U3.5 22.51,20.42 22.48,20.39 22.48,19.75 22.51,19.71 22.51,19.09 R3.1 22.47,16.8 C7.2 24.3,13.46 U4.14 29.61,13.46 C5.2 31.84,15.69 31.84,16.14 34.87,19.18 35.32,19.18 38.47,22.32 v1(41.57,22.32) ; D2.2 18.83,22.72
  Bottom Layer w0.381: v1(47.62,32.95) 46.74,32.07 v1(44.58,32.07) ; v1(18.21,17.67) 17.83,18.05 v1(12.95,18.05)
  Bottom Layer w0.635: v1(7.11,37.85) 5.45,36.19 MOTOR.4
  vias: v1(15.11,35.94) v1(15.11,32.39) v1(23.11,32.39)
CHASSIS_CANH: length 45.2
  Top Layer w0.381: 37.21,31.6 37.59,31.6 41.02,35.03 R_TERM.1 ; 37.21,31.6 36.45,31.6 v1(31.11,26.27) ; 37.21,31.6 U2.7 ; v1(7.49,19.03) 5.21,19.03 RPMSpeedCANHCANL.2
  Bottom Layer w0.381: v1(31.11,26.27) 29.59,24.74 13.21,24.74 v1(7.49,19.03)
CHASSIS_CANL: length 37.3
  Top Layer w0.381: v1(7.55,21.4) RPMSpeedCANHCANL.1 ; U2.6 37.1,32.77 R2.1 33.02,32.77 v1(32.64,32.39)
  Bottom Layer w0.381: v1(7.55,21.4) 16.26,30.11 28.07,30.11 28.45,30.49 28.45,30.87 30.35,32.77 32.26,32.77 v1(32.64,32.39)
CHASSIS_RX: length 13.8
  Top Layer w0.381: U2.4 45.59,34.04 52.7,26.92 U4.24
CHASSIS_TX: length 12.8
  Top Layer w0.381: U2.1 44.17,30.23 50.65,23.75 52.58,23.75 U4.25
CONTROL_TRANS6: length 30
  Top Layer w0.381: R12.2 46.87,39.12 v1(30.49,39.12) ; Q2.1 21.39,39.12 R13.2 23.88,38.35 25.15,38.35 27.06,40.26 27.82,40.26 v1(28.58,39.5)
  Bottom Layer w0.381: v1(28.58,39.5) 28.96,39.12 v1(30.49,39.12)
ECU_RPM: length 48
  Top Layer w0.381: v1(24.08,39.35) 24.08,40.11 26.74,42.78 27.89,42.78 31.31,46.21 R4.2
  Bottom Layer w0.381: RPMSpeedCANHCANL.4 3.88,15.1 3.88,17.25 4.26,17.63 5.79,17.63 6.55,18.39 6.55,21.82 v1(24.08,39.35)
ESP_MK2RPM: length 2.4
  Top Layer w0.381: U4.17 52.68,43.92 R7.1
ESP_MOTOR: length 2.8
  Top Layer w0.381: U4.20 51.82,37.21 R12.1
ESP_RPM: length 25.1
  Top Layer w0.381: U4.22 53.86,32.39 53.86,44.45 53.09,45.21 50.43,45.21 48.52,47.12 47.76,47.12 R6.2 OK1.3
ESP_SPEEDPULSE: length 28.6
  Top Layer w0.381: R11.2 46.47,40.39 OK2.3 41.77,40.39 v1(41.38,40) ; U4.9 29.57,28.43 v1(29.57,34.53)
  Bottom Layer w0.381: v1(41.38,40) 35.05,40 v1(29.57,34.53)
GPS_RX: length 15.4
  Bottom Layer w0.381: U4.13 28.72,16 GPS.2
GPS_TX: length 20.7
  Top Layer w0.381: U4.11 30.08,18.31 v1(30.08,18.29)
  Bottom Layer w0.381: GPS.3 30.08,17.14 v1(30.08,18.29)
MK2RPM: length 17.6
  Top Layer w0.381: Q1.3 13.74,40.25 13.74,41.4 11.46,43.69 L2.1 7.45,48.64 12vGNDMK2RPM.1
MOTOR_DIR: length 55.5
  Bottom Layer w0.381: U4.21 29.08,33.78 27.69,35.18 26.54,35.18 25.4,36.32 25.4,38.99 24.26,40.13 23.88,40.13 17.4,33.66 MOTOR.3
MOTOR_OUT: length 16.2
  Top Layer w0.381: v1(16.56,40.57) R10.1 18.5,40.57 Q2.3
  Bottom Layer w0.381: v1(16.56,40.57) 5.9,40.57 MOTOR.5
N$6: length 11.5
  Top Layer w0.635: U3.2 17.41,21.98 16.41,20.98 16.38,20.98 D2.1 17.1,16.39 L1.1
N$7: length 31.6
  Top Layer w0.381: U3.4 20.96,22.84 R3.2 20.7,18.79 20.7,14.84 16.89,11.03 13.84,11.03 10.41,7.6 ; C8.2 10.41,7.6 ; 10.41,7.6 8.75,9.27 VR1.3 VR1.2
PWR_IN: length 20.5
  Top Layer w0.635: D1.2 D3.1 5.43,37.15 5.43,45.66 12vGNDMK2RPM.3
SPEEDPULSE: length 56.1
  Top Layer w0.381: 30.49,21.97 31.25,21.21 35.06,21.21 R5.1 ; 30.49,21.97 30.11,22.35 25.54,22.35 v1(23.25,20.07) ; 30.49,21.97 30.49,22.35 30.11,22.73 30.11,28.07 31.25,29.21 31.25,37.21 29.73,38.73 29.73,41.4 R8.2
  Bottom Layer w0.381: RPMSpeedCANHCANL.3 5.31,16.64 19.82,16.64 v1(23.25,20.07)
$1N14244: length 2.9
  Top Layer w0.381: R1.2 39.09,28.24 U2.8
$1N14293: length 5.6
  Top Layer w0.381: R_TERM.2 37.35,37.47 R2.2
$1N14383: length 2.7
  Top Layer w0.381: OK2.1 R8.1
$1N14386: length 3.6
  Top Layer w0.381: R5.2 35.3,22.48 SpeedPulse.2
$1N14388: length 19
  Top Layer w0.381: v1(15.24,39.59) 15.24,40.35 16.76,41.87 20.19,41.87 21.72,43.4 21.72,48.54 L2.2 ; D3.2 v1(13.33,38.06)
  Bottom Layer w0.381: v1(13.33,38.06) 13.72,38.06 v1(15.24,39.59)
$1N14393: length 40.7
  Top Layer w0.381: v1(12.43,41.59) 12.05,41.21 Q1.1 10.23,40.83 R9.2 ; R7.2 48.67,43.76 v1(48.67,43.16)
  Bottom Layer w0.381: v1(48.67,43.16) 28.09,43.16 27.67,42.73 13.57,42.73 v1(12.43,41.59)
$1N14714: length 2.6
  Top Layer w0.381: OK1.1 32.84,48.51 32.82,48.49

## Copper pours and planes (outline as drawn; the poured copper is in the pictures)
GND on Bottom Layer: 0,56.39 57.15,56.39 57.15,0 0,0

## Text on the board
Top Silkscreen Layer: Forbes-Automotive.com '25 | SpeedPulserPro
